# EAGLE design Hardware_v4 (EAGLE 9.3.1)
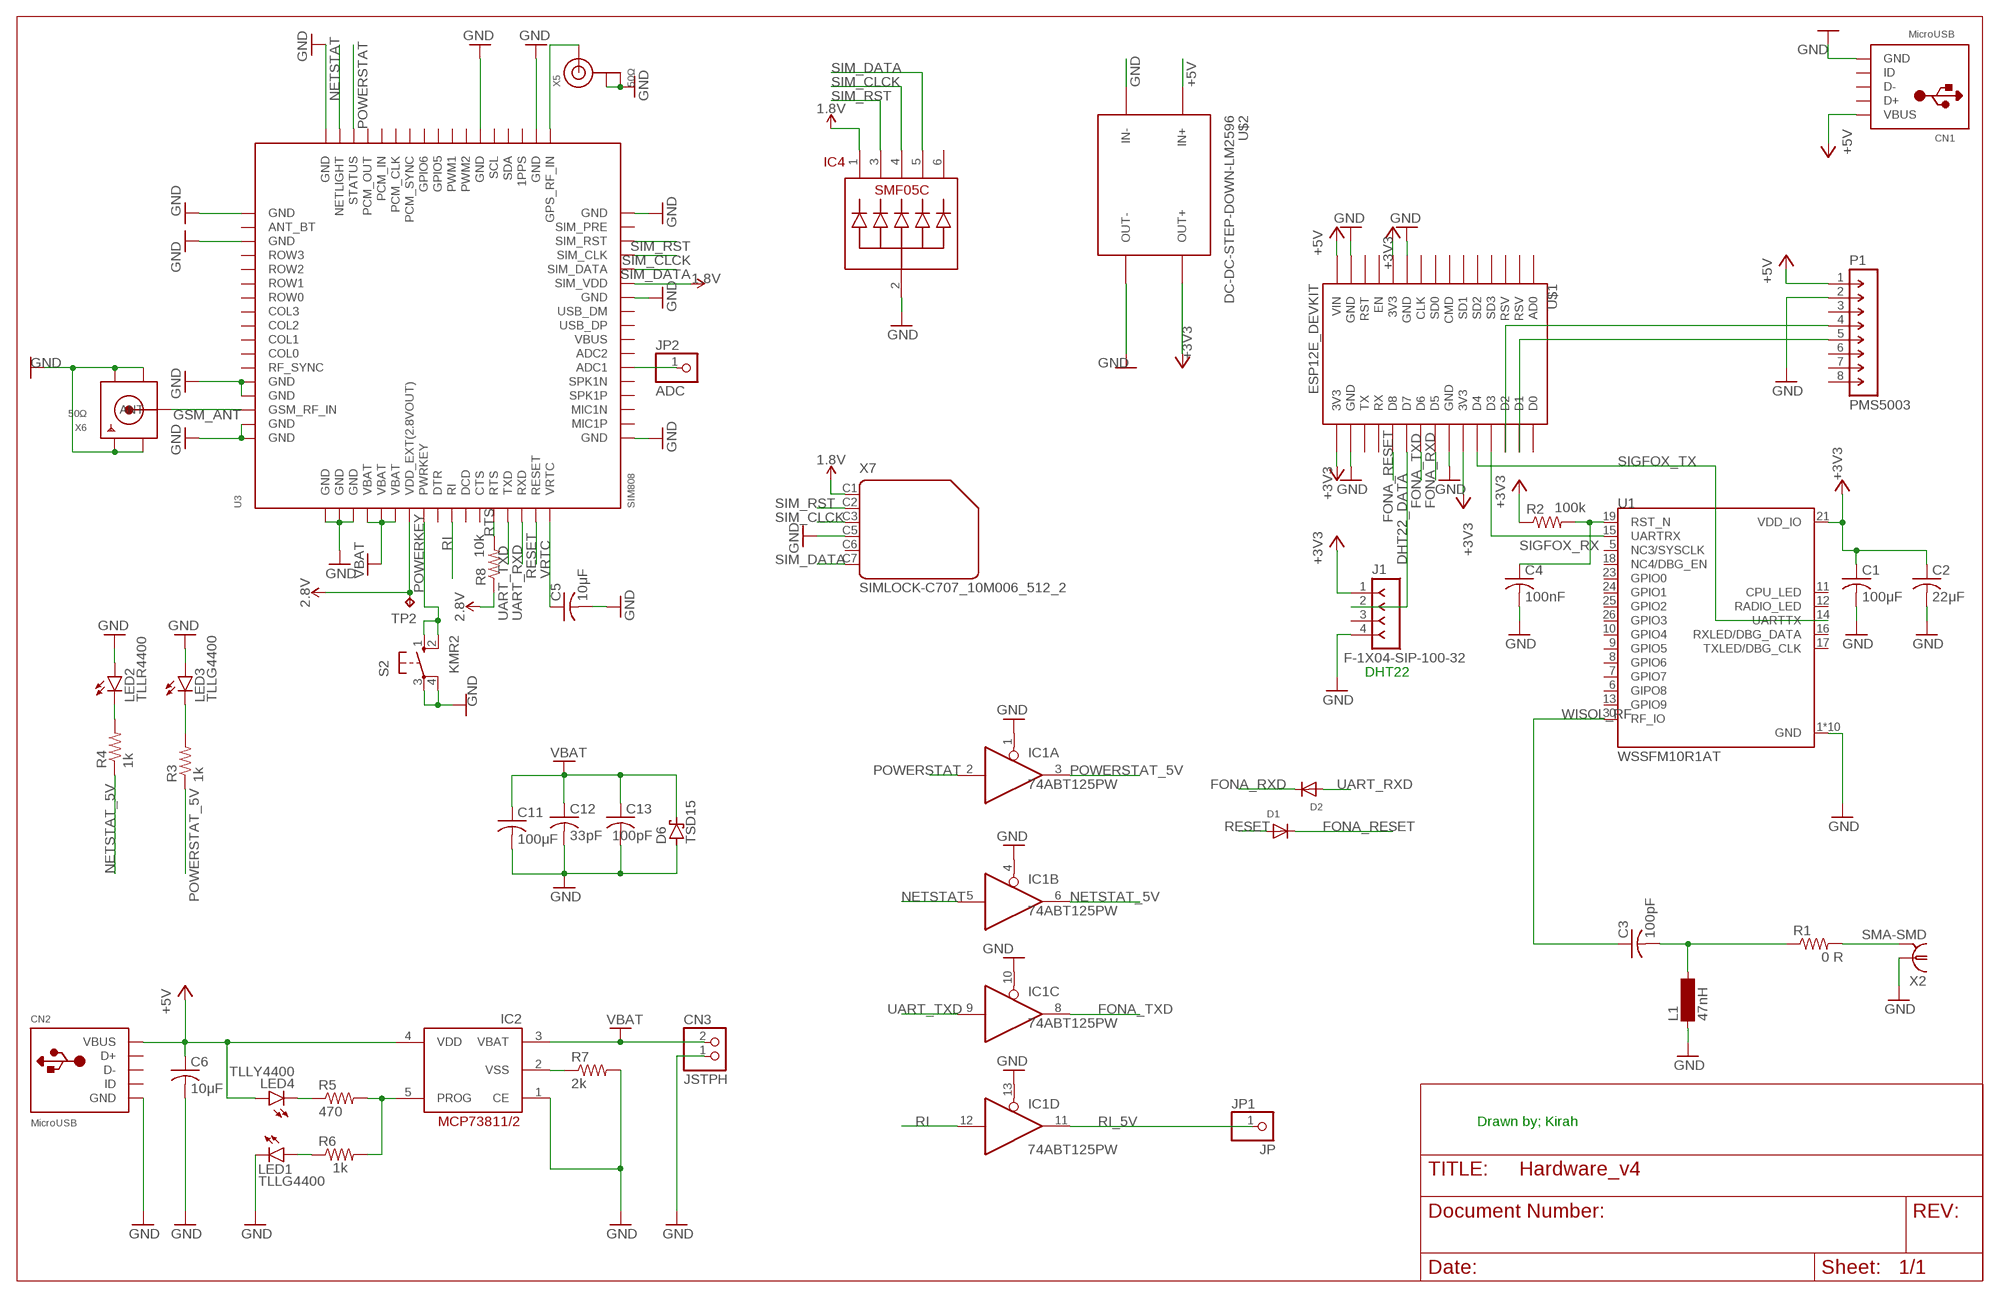
[diagram p0: schematic, sheet 1]

## Parts
C1  100μF  C-USC0201  [C0201]
C2  22μF  C-USC0201  [C0201]
C3  100pF  C-USC0402K  [C0402K]
C4  100nF  C-USC0201  [C0201]
C5  10μF  C-USC0201  [C0201]
C6  10μF  C-USC0201  [C0201]
C11  100μF  C-USC0402  [C0402]
C12  33pF  C-USC0402  [C0402]
C13  100pF  C-USC0402  [C0402]
CN1  MicroUSB  USBMINIB  [USB-MINIB]
CN2  MicroUSB  USBMINIB  [USB-MINIB]
CN3  JSTPH  JST_2PIN-SMT  [JST-PH-2-SMT]
D1  DIODESMA  [SMADIODE]
D2  DIODESMA  [SMADIODE]
D6  TSD15  [CB429-15]
IC1  74ABT125PW  [TSSOP14]
IC2  MCP73811/2  [SOT23-5L]
IC4  SMF05C  [SC-70-6]
J1  F-1X04-SIP-100-32  [SIP-100-04-32]
JP1  JP  PINHD-1X1CB  [1X01-CLEANBIG]
JP2  ADC  PINHD-1X01_2.00  [1X01M]
L1  47nH  SM-1206  [SM-1206]
LED1  TLLG4400  [LED3MM]
LED2  TLLR4400  [LED3MM]
LED3  TLLG4400  [LED3MM]
LED4  TLLY4400  [LED3MM]
P1  PMS5003  M-1X08-SIP-100-40  [SIP-100-08-40]
R1  0 R  R-US_01005  [R01005]
R2  100k  R-US_R0201  [R0201]
R3  1k  R-US_01005  [R01005]
R4  1k  R-US_01005  [R01005]
R5  470  R-US_01005  [R01005]
R6  1k  R-US_01005  [R01005]
R7  2k  R-US_01005  [R01005]
R8  10k  R-US_01005  [R01005]
S2  KMR2  40/XX  [B3F/40XX]
TP2  TPTP10R  [TP10R]
U1  WSSFM10R1AT  [XCVR_WSSFM10R1AT]
U3  SIM808  GSM_SIM808_LITERAL  [SIM900_SMT]
U$1  ESP12E_DEVKIT  [ESP12E_DEVKIT]
U$2  DC-DC-STEP-DOWN-LM2596  [DC-DC-STEP-DOWN-LM2596]
X2  SMA-SMD  [SMA-SMD]
X5  50Ω  ANTENNA_U.FL  [U.FL]
X6  50Ω  SMACONNECTOR_EDGE_UFL  [SMA_EDGELAUNCH_UFL]
X7  SIMLOCK-C707_10M006_512_2  [C707_10M006_512_2]

## Nets
1.8V [POWER]: IC4.1 U3.P$29(SIM_VDD) X7.C1
2.8V [POWER]: R8.1 TP2.TP U3.P$7(VDD_EXT(2.8VOUT))
+3V3 [POWER]: C1.1 C2.1 J1.1 R2.1 U1.21(VDD_IO) U$1.3V3@0(3V3) U$1.3V3@1(3V3) U$1.3V3@2(3V3) U$2.OUT+
+5V [POWER]: C6.1 CN1.VBUS CN2.VBUS IC2.4(VDD) LED4.A P1.1 U$1.VIN U$2.IN+
DHT22_DATA: J1.2 U$1.D7
FONA_RESET: D1.C U$1.D8
FONA_RXD: D2.C U$1.D5
FONA_TXD: IC1.8(C:O) U$1.D6
GND [GND]: C1.2 C2.2 C4.2 C5.2 C6.2 C11.2 C12.2 C13.2 CN1.GND CN2.GND CN3.1 D6.A IC1.1(A:OE) IC1.4(B:OE) IC1.10(C:OE) IC1.13(D:OE) IC2.1(CE) IC4.2 J1.4 L1.1 LED1.K(C) LED2.A LED3.A P1.2 R7.2 S2.3(P) S2.4(P1) U1.1(GND) U1.2(GND) U1.3(GND) U1.4(GND) U1.20(GND) U1.22(GND) U1.27(GND) U1.28(GND) U1.29(GND) U1.31(GND) U3.P$1(GND) U3.P$2(GND) U3.P$3(GND) U3.P$18(GND) U3.P$28(GND) U3.P$34(GND) U3.P$36(GND) U3.P$40(GND) U3.P$51(GND) U3.P$52(GND) U3.P$54(GND) U3.P$64(GND) U3.P$65(GND) U3.P$67(GND) U3.P$68(GND) U$1.GND@0(GND) U$1.GND@1(GND) U$1.GND@2(GND) U$1.GND@3(GND) U$2.IN- U$2.OUT- X2.1 X5.1(GND) X5.2(GND) X6.GND@1(GND1) X6.GND@2(GND2) X6.GND@3(GND3) X6.GND@4(GND4) X7.C5
GSM_ANT: U3.P$66(GSM_RF_IN) X6.P(ANT)
N$2: C4.1 R2.2 U1.19(RST_N)
N$3: P1.4 U$1.D2
N$4: P1.5 U$1.D1
N$5: C3.2 L1.2 R1.1
N$6: U3.P$35(GPS_RF_IN) X5.3(SIGNAL)
N$12: R1.2 X2.2@1 X2.2@2 X2.2@3 X2.2@4 X2.2@5 X2.2@6
N$13: JP2.1 U3.P$23(ADC1)
N$18: LED2.K(C) R4.2
N$21: LED3.K(C) R3.2
N$35: LED4.K(C) R5.1
N$36: IC2.5(PROG) R5.2 R6.2
N$37: LED1.A R6.1
NETSTAT: IC1.5(B:I) U3.P$50(NETLIGHT)
NETSTAT_5V: IC1.6(B:O) R4.1
POWERKEY: S2.1(S) S2.2(S1) U3.P$8(PWRKEY)
POWERSTAT: IC1.2(A:I) U3.P$49(STATUS)
POWERSTAT_5V: IC1.3(A:O) R3.1
RESET: D1.A U3.P$16(RESET)
RI: IC1.12(D:I) U3.P$10(RI)
RI_5V: IC1.11(D:O) JP1.1
RTS: R8.2 U3.P$13(RTS)
SIGFOX_RX: U1.15(UARTRX) U$1.D3
SIGFOX_TX: U1.14(UARTTX) U$1.D4
SIM_CLCK: IC4.4 U3.P$31(SIM_CLK) X7.C3
SIM_DATA: IC4.5 U3.P$30(SIM_DATA) X7.C7
SIM_RST: IC4.3 U3.P$32(SIM_RST) X7.C2
UART_RXD: D2.A U3.P$15(RXD)
UART_TXD: IC1.9(C:I) U3.P$14(TXD)
VBAT: C11.1 C12.1 C13.1 CN3.2 D6.C IC2.3(VBAT) U3.P$4(VBAT) U3.P$5(VBAT) U3.P$6(VBAT)
VRTC: C5.1 U3.P$17(VRTC)
VSS: IC2.2(VSS) R7.1
WISOL_RF: C3.1 U1.30(RF_IO)
Unconnected: CN1.D+ CN1.D- CN1.ID CN2.D+ CN2.D- CN2.ID IC4.6 J1.3 P1.3 P1.6 P1.7 P1.8 U1.5(NC3/SYSCLK) U1.6(GIPO8) U1.7(GPIO7) U1.8(GPIO6) U1.9(GPIO5) U1.10(GPIO4) U1.11(CPU_LED) U1.12(RADIO_LED) U1.13(GPIO9) U1.16(RXLED/DBG_DATA) U1.17(TXLED/DBG_CLK) U1.18(NC4/DBG_EN) U1.23(GPIO0) U1.24(GPIO1) U1.25(GPIO2) U1.26(GPIO3) U3.P$9(DTR) U3.P$11(DCD) U3.P$12(CTS) U3.P$19(MIC1P) U3.P$20(MIC1N) U3.P$21(SPK1P) U3.P$22(SPK1N) U3.P$24(ADC2) U3.P$26(USB_DP) U3.P$27(USB_DM) U3.P$33(SIM_PRE) U3.P$37(1PPS) U3.P$38(SDA) U3.P$39(SCL) U3.P$41(PWM2) U3.P$42(PWM1) U3.P$43(GPIO5) U3.P$44(GPIO6) U3.P$45(PCM_SYNC) U3.P$46(PCM_CLK) U3.P$47(PCM_IN) U3.P$48(PCM_OUT) U3.P$53(ANT_BT) U3.P$55(ROW3) U3.P$56(ROW2) U3.P$57(ROW1) U3.P$58(ROW0) U3.P$59(COL3) U3.P$60(COL2) U3.P$61(COL1) U3.P$62(COL0) U3.P$63(RF_SYNC) U$1.AD0 U$1.CLK U$1.CMD U$1.D0 U$1.EN U$1.RST U$1.RSV@0(RSV) U$1.RSV@1(RSV) U$1.RX U$1.SD0 U$1.SD1 U$1.SD2 U$1.SD3 U$1.TX X7.C6

## Notes on the sheet
- DHT22
- Drawn by; Kirah

## Power pins joined to a net without a drawn wire
GND: IC1.7(P:GND)
VBUS: U3.P$25(VBUS)
VCC: IC1.14(P:VCC)

## Library data of the parts
C1-C6 C11-C13 = rcl:C-US: CAPACITOR, American symbol; SPICEPREFIX: C
CN1 = adafruit:USB: USB Connectors USBMINIB - Surface Mount Female Mini-B USB Connector 4UConnector: 06564 By microbuilder.eu Thru-hole RA Female Mini-B USB Connector 4UConnector: 18732 By ladyada.net
CN2 = adafruit@1:USB: USB Connectors USBMINIB - Surface Mount Female Mini-B USB Connector 4UConnector: 06564 By microbuilder.eu Thru-hole RA Female Mini-B USB Connector 4UConnector: 18732 By ladyada.net
CN3 = adafruit:JST_2PIN: JST 2-Pin Connectors of various flavors SMT-RA (S2B-PH-SM4) 4UConnector #17311 SMT (B2B-PH-SM4) THM-RA (S2B-PH) THM (B2B-PH)
D1 D2 = adafruit:DIODE: Diode SMADIODE - SMA Surface Mount Package 20V 1A Schottky Diode Digikey: 641-1014-6-ND DO-1N4148 - Through Hole Small Current Diode SOD-123 20V 1 A (.5mV Vf) Schottky Diode - Digikey: MBRX120TPMSCT-ND SOD-323 10V 570mA (.38mV Vf, 3ns) Schottky Diode - Digikey: ZLLS410CT-ND SOD-523 30V 30mA Schottky Diode (RB751S-40TE61) - Digikey: RB751S-40TE61CT-ND SOT23-R/W - SOT23 Package (R = Solder Paste/Reflow Ovens, W = Hand-Soldering) BAT54Film 40V 300mA - Digikey: 497-7162-1-ND
D6 = diode:TSD15: DIODE
IC1 = 74xx-eu:74*125: Quad bus BUFFER, 3-state
IC2 = adafruit:MCP73811/2: MCP73811 and MCP73812 Simple, Miniature Single-Cell, Fully Integrated Li-Ion / Li-Polymer Charge Management Controllers SOT-23-5 package, no indicator LED but with adjustable current, small and very inexpensive
IC4 = smf05c:SMF05C
J1 = con-headers-jp:F-1X04-: FEMALE HEADER
JP1 = adafruit@2:PINHD-1X1: Pin header 1x1 for 0.1" spacing With round pins
JP2 = pinhead-2:PINHD-1X01: PIN HEADER
L1 = inductor-neosid:SM-1206: INDUCTOR SMD chip inductor; OC_FARNELL: unknown; OC_NEWARK: unknown
LED1 LED3 = led:TLLG4400: Low Current (2mA) LED 3 mm Tinted Diffused Package color GREEN Source: Data sheet <http://www.farnell.com/datasheets/391098.pdf>; MF: VISHAY SEMICONDUCTOR; OC_FARNELL: 1612435
LED2 = led:TLLR4400: Low Current (2mA) LED 3 mm Tinted Diffused Package color RED Source: Data sheet <http://www.farnell.com/datasheets/391100.pdf>; MF: VISHAY SEMICONDUCTOR; OC_FARNELL: 1612437
LED4 = led:TLLY4400: Low Current (2mA) LED 3 mm Tinted Diffused Package color YELLOW Source: Data sheet <http://www.farnell.com/datasheets/391098.pdf>; MF: VISHAY SEMICONDUCTOR; OC_FARNELL: 1612439
P1 = con-headers-jp:M-1X08-: MALE HEADER
R1-R8 = rcl:R-US_: RESISTOR, American symbol; SPICEPREFIX: R
S2 = switch-omron:40/XX: OMRON SWITCH; OC_FARNELL: unknown; OC_NEWARK: unknown
TP2 = testpad:TP: Test pad
U1 = WSSFM10R1AT:WSSFM10R1AT: Sigfox RF Module, Sub-1GHz , SMD; AVAILABILITY: Unavailable; DESCRIPTION: Sigfox Module Rcz1 At Version; MF: Avnet Design Services; MP: WSSFM10R1AT; PACKAGE: None; PRICE: None
U3 = adafruit:GSM_SIM808_LITERAL: SIM808 GSM Module
U$1 = ESP12E_DEVKIT:ESP12E_DEVKIT: ESP12E DEVKIT BOARD
U$2 = diy-modules:DC-DC-STEP-DOWN-LM2596: DC/DC Step-Down Regulator based on LM2596-ADJ chip LM2596 datasheet available here: http://www.ti.com/lit/ds/symlink/lm2596.pdf Click here to find device on ebay.com <http://www.ebay.com/sch/lm2596+power+regulator>
X2 = con-coax:SMA-SMD: SMA 50 Ohm Straight Jack Receptacle - Surface Mount www.johnsoncomponents.com Source: http://catalog.digikey.com .. 142-0711-201, 205, 202, 206.pdf; OC_FARNELL: unknown; OC_NEWARK: unknown
X5 = adafruit:ANTENNA_U.FL: U.FL Antenna Connector
X6 = adafruit@1:SMACONNECTOR: SMA Connector 90° DIP SMA Connector, 50 Ohm (4UConnector: 07259)
X7 = con-amphenol:SIMLOCK-C707_10M006_512_2: C707A SIMLOCK® 2.5 mm with wide solder tails Source: Data sheet <http://www.amphenol.info/downloads/C707_10M006_512_2.pdf>; OC_FARNELL: unknown; OC_NEWARK: unknown

## Net classes
1 POWER: width 0.305 mm
2 GND: width 0.254 mm

## Board
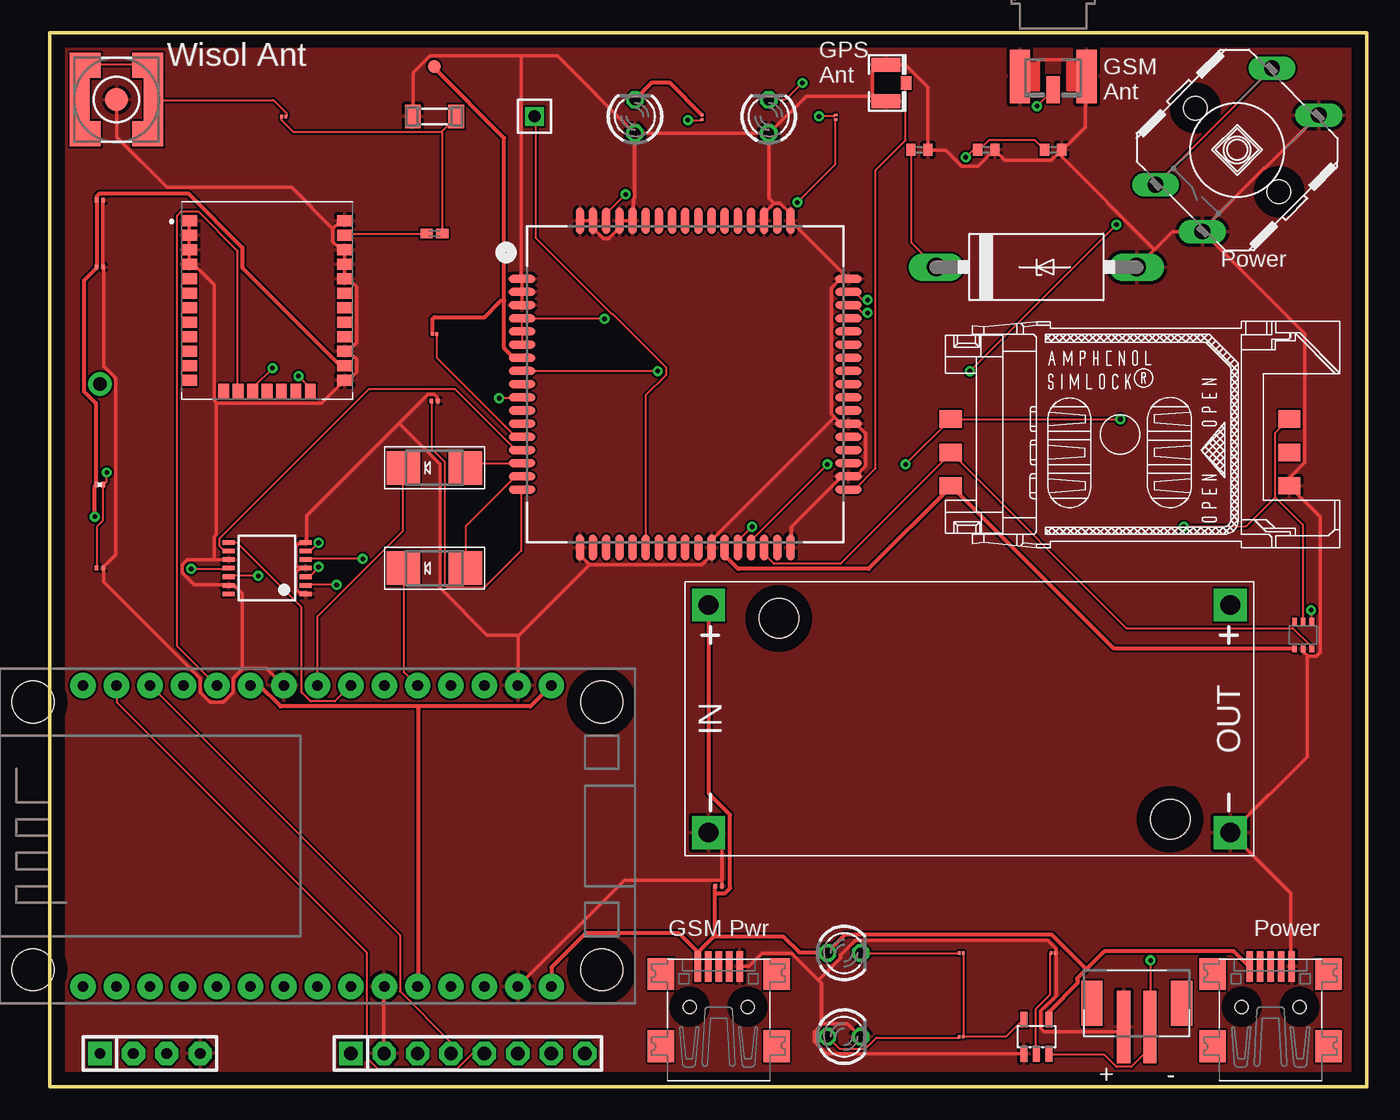
[diagram p1: board, top side]
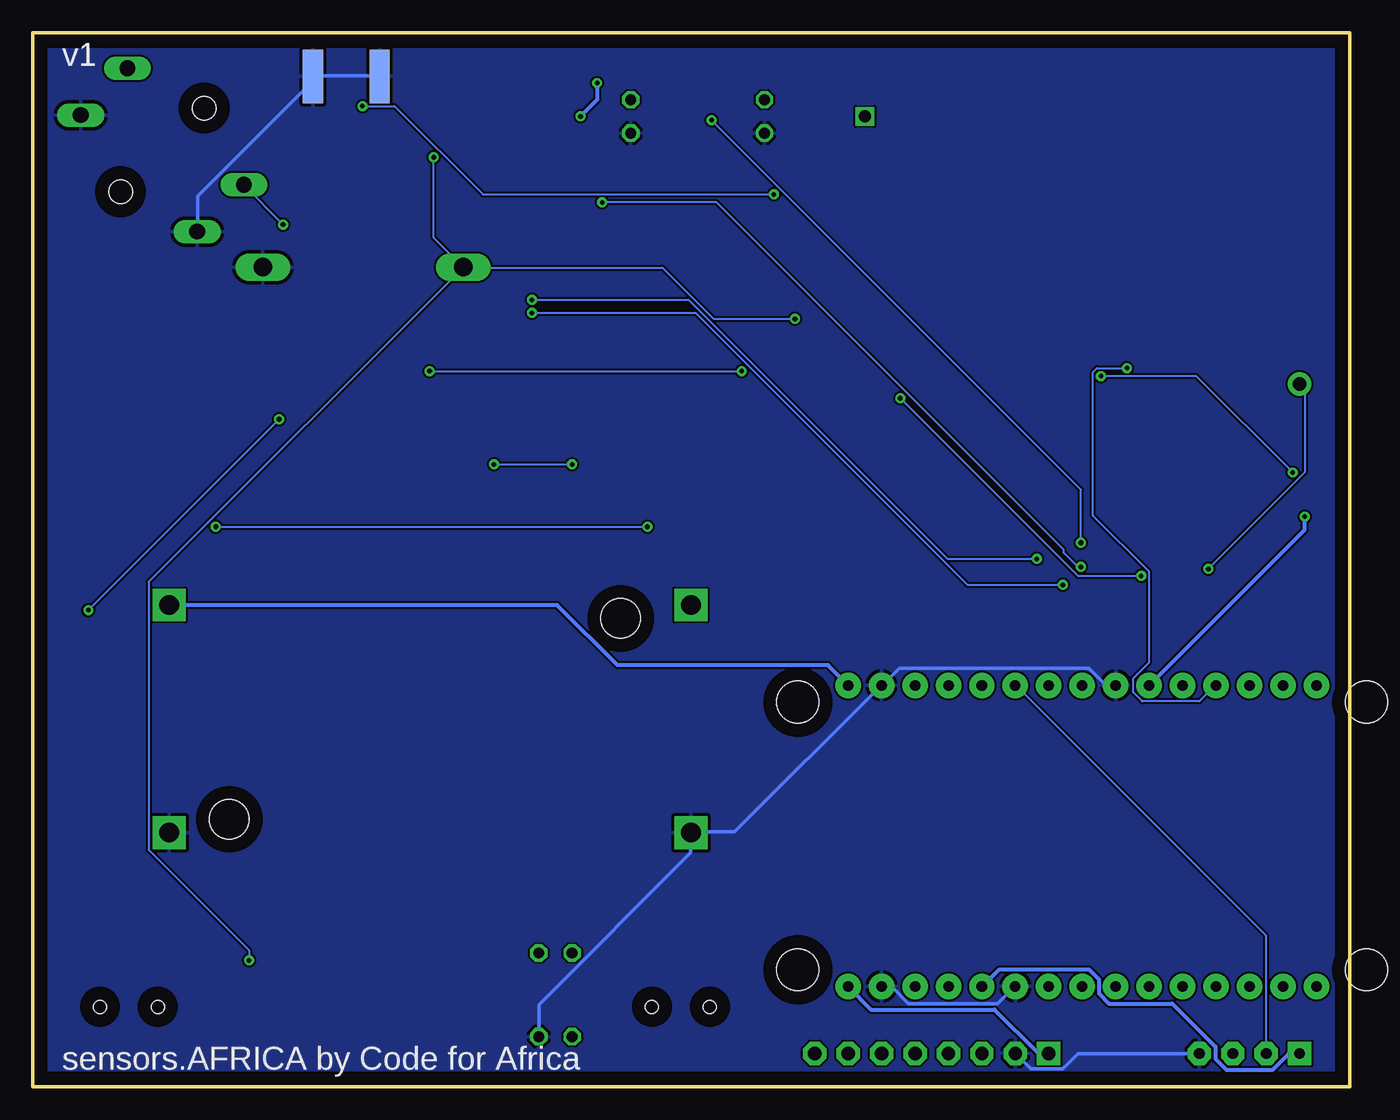
[diagram p2: board, bottom side, seen from below]

Size 100 x 80 mm. Coordinates in mm from the lower left corner, seen from the top.
Outline: 0,0 100,0 100,80 0,80 0,0
Copper layers (1*16): Top 0.035mm / dielectric 1.5mm / Bottom 0.035mm
Design rules "default": minimum track width 6mil, minimum drill 0.35mm, track to track 6mil, track to pad 6mil, pad to pad 6mil, via to via 6mil, smd to smd 6mil, copper to edge 40mil, drill to drill 6mil, minimum pad ring 10mil, minimum via ring 8mil, stop-mask expansion 4mil, vias tented up to drill 0mil, thermal gap 10mil

### Footprints (pad centres in the part's own frame; a part is rotated, then mirrored left to right if it is on the bottom)
C0201 = smd 0.25 x 0.35: 1 -0.25,0; 2 0.25,0
C0402K = smd 0.925 x 0.74: 1 -0.6,0; 2 0.6,0
C0402 = smd 0.7 x 0.9: 1 -0.65,0; 2 0.65,0
USB-MINIB = smd 0.5 x 2.308: D+ 0,4.064; D- -0.8,4.064; GND 1.6,4.064; ID 0.8,4.064; VBUS -1.6,4.064 | smd 2 x 2.4: GND1 -4.4,-2; GND2 -4.4,3.5; GND3 4.4,3.5; GND4 4.4,-2 | hole 1: -2.2,1; 2.2,1
JST-PH-2-SMT = smd 1 x 5.5: 1 -1,-1.8; 2 1,-1.8 | smd 1.6 x 3.4: NC1 -3.4,0; NC2 3.4,0
SMADIODE = smd 2.54 x 2.54: A 2.349,0; C -2.349,0
CB429-15 = drill 1.397 long: A 7.62,0; C -7.62,0
TSSOP14 = smd 0.35 x 0.9: 1 -1.95,-2.925; 2 -1.3,-2.925; 3 -0.65,-2.925; 4 0,-2.925; 5 0.65,-2.925; 6 1.3,-2.925; 7 1.95,-2.925; 8 1.95,2.925; 9 1.3,2.925; 10 0.65,2.925; 11 0,2.925; 12 -0.65,2.925; 13 -1.3,2.925; 14 -1.95,2.925
SOT23-5L = smd 0.55 x 1.2: 1 -0.95,-1.3; 2 0,-1.3; 3 0.95,-1.3; 4 0.95,1.3; 5 -0.95,1.3
SC-70-6 = smd 0.35 x 0.5: 1 -0.65,-1.05; 2 0,-1.05; 3 0.65,-1.05; 4 0.65,1.05; 5 0,1.05; 6 -0.65,1.05
SIP-100-04-32 = drill 0.813 pad 1.778 square: 1 -3.81,0 | drill 0.813 pad 1.778 octagon: 2 -1.27,0; 3 1.27,0; 4 3.81,0
1X01-CLEANBIG = drill 1.016 pad 1.778: 1 0,0
1X01M = drill 0.914 square: 1 0,0
SM-1206 = smd 1.2 x 1.8: 1 -1.65,0; 2 1.65,0
LED3MM = drill 0.813 octagon: A -1.27,0; K 1.27,0
SIP-100-08-40 = drill 1.016 pad 1.778 square: 1 -8.89,0 | drill 1.016 pad 1.778 octagon: 2 -6.35,0; 3 -3.81,0; 4 -1.27,0; 5 1.27,0; 6 3.81,0; 7 6.35,0; 8 8.89,0
R01005 = smd 0.2 x 0.25: 1 -0.163,0; 2 0.163,0
R0201 = smd 0.28 x 0.43: 1 -0.255,0; 2 0.255,0
B3F/40XX = drill 1.194 long: 1 -6.198,-2.642; 2 2.642,6.198; 3 -2.642,-6.198; 4 6.198,2.642 | hole 1.803: -3.175,3.175; 3.175,-3.175
TP10R = smd 1 x 1: TP 0,0
XCVR_WSSFM10R1AT = smd 1.15 x 0.81: 1 -5.9,6.05; 2 -5.9,4.95; 3 -5.9,3.85; 4 -5.9,2.75; 5 -5.9,1.65; 6 -5.9,0.55; 7 -5.9,-0.55; 8 -5.9,-1.65; 9 -5.9,-2.75; 10 -5.9,-3.85; 11 -5.9,-4.95; 12 -5.9,-6.05; 20 5.9,-6.05; 21 5.9,-4.95; 22 5.9,-3.85; 23 5.9,-2.75; 24 5.9,-1.65; 25 5.9,-0.55; 26 5.9,0.55; 27 5.9,1.65; 28 5.9,2.75; 29 5.9,3.85; 30 5.9,4.95; 31 5.9,6.05 | smd 0.81 x 1.15: 13 -3.3,-6.9; 14 -2.2,-6.9; 15 -1.1,-6.9; 16 0,-6.9; 17 1.1,-6.9; 18 2.2,-6.9; 19 3.3,-6.9
SIM900_SMT = smd 2 x 0.6: P$1 -12.4,8; P$2 -12.4,7; P$3 -12.4,6; P$4 -12.4,5; P$5 -12.4,4; P$6 -12.4,3; P$7 -12.4,2; P$8 -12.4,1; P$9 -12.4,0; P$10 -12.4,-1; P$11 -12.4,-2; P$12 -12.4,-3; P$13 -12.4,-4; P$14 -12.4,-5; P$15 -12.4,-6; P$16 -12.4,-7; P$17 -12.4,-8; P$35 12.4,-8; P$36 12.4,-7; P$37 12.4,-6; P$38 12.4,-5; P$39 12.4,-4; P$40 12.4,-3; P$41 12.4,-2; P$42 12.4,-1; P$43 12.4,0; P$44 12.4,1; P$45 12.4,2; P$46 12.4,3; P$47 12.4,4; P$48 12.4,5; P$49 12.4,6; P$50 12.4,7; P$51 12.4,8 | smd 0.6 x 2: P$18 -8,-12.4; P$19 -7,-12.4; P$20 -6,-12.4; P$21 -5,-12.4; P$22 -4,-12.4; P$23 -3,-12.4; P$24 -2,-12.4; P$25 -1,-12.4; P$26 0,-12.4; P$27 1,-12.4; P$28 2,-12.4; P$29 3,-12.4; P$30 4,-12.4; P$31 5,-12.4; P$32 6,-12.4; P$33 7,-12.4; P$34 8,-12.4; P$52 8,12.4; P$53 7,12.4; P$54 6,12.4; P$55 5,12.4; P$56 4,12.4; P$57 3,12.4; P$58 2,12.4; P$59 1,12.4; P$60 0,12.4; P$61 -1,12.4; P$62 -2,12.4; P$63 -3,12.4; P$64 -4,12.4; P$65 -5,12.4; P$66 -6,12.4; P$67 -7,12.4; P$68 -8,12.4
ESP12E_DEVKIT = drill 0.8 pad 1.93: 3V3@0 -11.43,-7.62; 3V3@1 11.43,5.08; 3V3@2 11.43,-17.78; AD0 -11.43,17.78; CLK -11.43,-2.54; CMD -11.43,2.54; D0 11.43,17.78; D1 11.43,15.24; D2 11.43,12.7; D3 11.43,10.16; D4 11.43,7.62; D5 11.43,0; D6 11.43,-2.54; D7 11.43,-5.08; D8 11.43,-7.62; EN -11.43,-10.16; GND@0 -11.43,-5.08; GND@1 -11.43,-15.24; GND@2 11.43,2.54; GND@3 11.43,-15.24; RST -11.43,-12.7; RSV@0 -11.43,15.24; RSV@1 -11.43,12.7; RX 11.43,-10.16; SD0 -11.43,0; SD1 -11.43,5.08; SD2 -11.43,7.62; SD3 -11.43,10.16; TX 11.43,-12.7; VIN -11.43,-17.78 | hole 3.2: -10.16,21.59; 10.16,21.59; 10.16,-21.59; -10.16,-21.59
DC-DC-STEP-DOWN-LM2596 = drill 1.5 pad 2.5 square: IN+ -19.812,8.636; IN- -19.812,-8.636; OUT+ 19.812,8.636; OUT- 19.812,-8.636 | hole 3: -14.478,7.62; 15.24,-7.62
SMA-SMD = smd 1.73 x 1.73: 1 0,0 | smd 2.35 x 1.9: 2@1 -2.375,2.6; 2@2 -2.375,-2.6; 2@3 2.375,-2.6; 2@4 2.375,2.6 | smd 1.5 x 3.4: 2@5 -2.8,0; 2@6 2.8,0
U.FL = smd 2.2 x 1.05: 1 0,1.375; 2 0,-1.375 | smd 0.8 x 1: 3 1.525,0
SMA_EDGELAUNCH_UFL = smd 4.064 x 1.524: GND@1 2.032,-2.54; GND@2 2.032,2.54 | smd 4.064 x 1.524 bottom: GND@3 2.032,2.54; GND@4 2.032,-2.54 | smd 2.032 x 1.016: P 3.048,0
C707_10M006_512_2 = smd 1.7 x 1.3: C1 -12.85,-3.915; C2 -12.85,-1.375; C3 -12.85,1.165; C5 12.85,-3.915; C6 12.85,-1.375; C7 12.85,1.165

### Placement (x,y rotation side)
C1  3.81,67.31 0 top
C2  3.81,62.23 0 top
C3  29.22,64.77 0 top
C4  3.81,39.37 0 top
C5  29.22,52.07 0 top
C6  50.8,15.24 0 top
C11  66.04,71.12 0 top
C12  71.12,71.12 0 top
C13  76.2,71.12 0 top
CN1  92.71,5.08 0 top
CN2  50.8,5.08 0 top
CN3  82.55,6.35 0 top
D1  29.21,39.37 0 top
D2  29.21,46.99 0 top
D6  74.93,62.23 0 top
IC1  16.51,39.37 90 top
IC2  74.93,3.81 0 top
IC4  95.19,34.29 0 top
J1  7.62,2.54 0 top
JP1  3.81,53.34 0 top
JP2  36.83,73.66 0 top
L1  29.22,73.66 0 top
LED1  60.33,3.81 0 top
LED2  44.45,73.66 90 top
LED3  54.61,73.66 90 top
LED4  60.33,10.16 0 top
P1  31.75,2.54 0 top
R1  17.78,73.66 0 top
R2  3.81,45.72 0 top
R3  59.69,73.6 90 top
R4  49.53,73.6 90 top
R5  69.22,10.16 0 top
R6  69.22,3.81 0 top
R7  76.2,10.16 0 top
R8  29.22,57.15 0 top
S2  90.17,71.12 0 top
TP2  29.22,77.47 0 top
U1  16.51,59.69 0 top
U3  48.26,53.34 0 top
U$1  20.32,19.05 90 top
U$2  69.85,27.94 0 top
X2  5.08,74.93 0 top
X5  63.5,76.2 0 top
X6  76.2,78.74 270 top
X7  81.28,49.53 0 top

### Tracks (layer width: path | path; a pad name or v marks a point on that pad's centre or on a via)
1.8V
  Top 0.305: IC4.1 94.49,33.3 80.77,33.3 68.5,45.57 X7.C1 68.35,45.49 62.18,39.32 52.27,39.32 51.28,40.31 51.28,40.92 U3.P$29
2.8V
  Top 0.305: 34.52,59.69 34.52,56.08 35.2,55.4 35.81,55.4 U3.P$7 | 34.52,59.69 34.52,72.01 29.26,77.27 29.26,77.42 TP2.TP | R8.1 29.06,58.27 29.21,58.42 33.02,58.42 34.29,59.69 34.52,59.69
+3V3  (via drill 0.35)
  Top 0.305: U1.21 22.4,54.79 22.02,54.79 14.63,62.18 14.63,63.7 10.52,67.82 3.81,67.82 3.58,67.59 3.58,67.44 C1.1 3.58,67.28 3.58,62.26 C2.1 3.5,62.1 2.59,61.19 2.59,52.81 3.5,51.89 3.5,45.72 R2.1 3.43,45.64 v3.43,43.28 | U$1.3V3@1 15.93,30.48 17.53,28.88 27.96,28.88 | 27.96,28.88 36.5,28.88 U$1.3V3@2 | 27.96,28.88 27.96,7.62 U$1.3V3@0
  Bottom 0.305: J1.1 3.81,2.52 4.65,2.52 5.87,1.29 9.37,1.29 10.21,2.13 10.21,3.05 13.49,6.33 18.29,6.33 19.05,7.09 19.05,8.15 19.81,8.91 26.59,8.91 27.89,7.62 U$1.3V3@0 | U$2.OUT+ 60.2,36.58 55.63,32 39.62,32 U$1.3V3@2 | v3.43,43.28 3.43,42.29 U$1.3V3@1
+5V
  Top 0.305: 78.72,8.91 80.09,10.29 89.92,10.29 91.06,9.14 CN1.VBUS | 78.72,8.91 78.03,8.23 78.03,7.85 75.89,5.71 75.89,5.18 IC2.4 | 50.52,11.51 50.52,14.71 | 50.52,14.71 50.52,15.24 C6.1 | 50.52,11.51 49.23,10.21 49.23,9.14 CN2.VBUS 49.15,10.29 47.78,11.66 40.69,11.66 38.1,9.07 U$1.VIN | 50.52,11.51 50.6,11.43 55.7,11.43 56.92,10.21 59.05,10.21 LED4.A 59.13,10.29 60.43,11.58 76.05,11.58 78.72,8.91 | 50.52,14.71 51.28,14.71 51.66,15.09 51.66,20.65 50.06,22.25 50.06,36.58 U$2.IN+
  Bottom 0.305: U$1.VIN 36.35,5.87 26.98,5.87 23.7,2.59 22.86,2.59 P1.1
DHT22_DATA
  Bottom 0.152: J1.2 6.4,2.59 6.4,11.51 25.38,30.48 U$1.D7
FONA_RESET
  Top 0.152: D1.C 26.9,39.32 26.9,31.47 27.89,30.48 U$1.D8
FONA_RXD
  Top 0.152: D2.C 26.82,46.94 26.82,42.22 20.34,35.74 20.34,30.48 U$1.D5
FONA_TXD
  Top 0.152: U$1.D6 21.64,29.26 19.81,29.26 19.13,29.95 19.13,36.42 14.25,41.3 13.64,41.3 IC1.8
GND
  Top 0.254: CN3.1 81.53,4.5 81.23,4.19 75.51,4.19 75.29,4.42 75.29,5.79 76.43,6.93 76.43,10.13 R7.2 76.43,10.21 76.43,10.44 75.74,11.12 61.19,11.12 60.05,9.98 60.05,9.75 58.37,8.08 | 58.67,4.8 58.06,4.19 58.06,3.43 58.98,2.52 73.91,2.52 IC2.1 | 58.67,4.8 60.58,4.8 61.57,3.81 LED1.K | CN2.GND 53.11,9.14 54.1,10.13 56.31,10.13 58.37,8.08 | 58.37,8.08 58.6,7.85 58.6,4.88 58.67,4.8 | 51.05,15.7 51.05,18.29 U$2.IN- | 51.05,15.7 C6.2 | U$1.GND@0 25.38,7.62 25.38,2.59 P1.2 | 51.05,15.7 43.66,15.7 35.59,7.62 U$1.GND@1 | U1.1 10.59,65.68 10.59,64.69 U1.2 10.59,64.54 10.59,63.63 U1.3 10.59,63.48 10.59,62.48 U1.4 10.67,62.33 11.05,62.33 12.5,60.88 12.5,52.12 12.72,51.89 | 21.49,65.15 22.02,65.68 22.4,65.68 U1.31 | 21.49,65.15 21.49,64.16 22.02,63.63 22.33,63.63 U1.29 22.4,63.48 22.4,62.56 U1.28 22.4,62.41 U1.27 22.48,61.27 22.78,61.27 23.32,60.73 23.32,56.46 22.86,56.01 22.86,55.85 U1.22 22.48,55.78 22.78,55.78 23.32,55.24 23.32,54.25 22.71,53.65 22.48,53.65 U1.20 22.33,53.57 20.65,51.89 12.72,51.89 | 21.49,65.15 18.36,68.28 8.91,68.28 5.11,72.08 5.11,74.91 X2.1 | C1.2 4.04,67.28 4.04,62.26 C2.2 4.12,62.18 4.12,54.71 5.03,53.8 5.03,40.39 4.12,39.47 C4.2 4.12,39.32 4.12,38.33 11.43,31.01 11.43,29.95 12.19,29.18 13.18,29.18 13.95,29.95 13.95,31.01 14.71,31.77 | 14.71,31.77 16.46,31.77 17.75,30.48 U$1.GND@2 | 14.71,31.77 14.63,31.85 14.63,37.41 14.02,38.02 13.64,38.02 IC1.13 13.49,38.1 10.97,38.1 10.06,39.01 10.06,39.62 10.44,40.01 12.5,40.01 | 12.5,40.01 13.56,40.01 IC1.10 | 12.5,40.01 12.5,41.76 12.65,41.91 12.65,51.82 12.72,51.89 | 18.97,39.32 18.67,39.01 18.67,37.8 18.97,37.49 19.43,37.49 IC1.1
  Top 0.254: 18.97,39.32 19.43,39.32 IC1.4 | 26.52,50.37 19.51,43.36 19.51,41.38 IC1.7 19.36,41.22 18.9,41.22 18.67,41 18.67,39.62 18.97,39.32 | 26.52,50.37 28.73,52.58 29.18,52.58 29.41,52.35 29.41,52.12 C5.2 | 41,39.62 40.31,40.31 40.31,40.92 U3.P$18 | 41,39.62 49.53,39.62 50.22,40.31 50.22,40.92 U3.P$28 50.37,41 50.37,41.6 59.59,50.83 | 35.59,34.21 35.59,30.48 U$1.GND@3 | 41,39.62 35.59,34.21 | 26.52,50.37 29.64,47.24 29.64,37.87 33.22,34.29 35.51,34.29 35.59,34.21 | 95.56,32.69 95.25,32.99 95.25,33.22 IC4.2 | 95.56,32.69 96.16,32.69 96.47,32.99 96.47,43.28 94.18,45.57 X7.C5 94.18,45.72 94.18,46.25 95.33,47.4 95.33,57.15 87.63,64.85 S2.3 | CN1.GND 94.26,9.14 94.26,14.71 U$2.OUT- 89.76,19.36 95.48,25.07 95.48,32.61 95.56,32.69 | S2.3 85.27,64.92 83.9,63.55 | 83.9,63.55 82.6,62.26 D6.A | S2.4 96.32,73.76 92.28,69.72 92.2,69.72 87.48,65 S2.3 | U3.P$68 40.31,65.76 41.22,65.76 U3.P$67 41.3,65.68 41.3,65.15 42.06,64.39 42.44,64.39 43.2,65.15 43.2,65.68 U3.P$65 43.28,65.76 44.2,65.76 U3.P$64 44.35,65.84 44.35,67.36 44.42,67.44 44.42,72.31 LED2.A | U3.P$3 35.89,59.36 35.89,60.27 U3.P$2 35.89,60.43 35.89,61.27 U3.P$1 35.81,61.42 35.81,78.26 | 35.81,78.26 38.56,78.26 44.42,72.39 LED2.A | 35.81,78.26 28.88,78.26 27.58,76.96 27.58,73.69 L1.1 | X6.GND@4 73.69,76.73 73.99,76.73 75.21,77.95 77.5,77.95 X6.GND@3 78.64,76.66 78.64,72.85 76.96,71.17 C13.2 | C13.2 76.81,71.09 76.05,70.33 72.54,70.33 71.86,71.02 C12.2 71.7,71.09 70.48,69.88 69.27,69.88 68.05,71.09 66.75,71.09 C11.2 66.67,71.25 66.67,75.89 65,77.57 63.63,77.57 X5.1 63.48,77.57 62.94,77.57 62.48,77.11 62.48,75.29 62.94,74.83 63.48,74.83 X5.2 62.41,75.21 57.45,75.21 54.71,72.47 LED3.A
  Top 0.254: U3.P$34 56.31,41 56.31,42.52 60.12,46.33 U3.P$36 60.73,46.41 61.27,46.41 61.95,47.09 61.95,49.61 61.27,50.29 60.73,50.29 U3.P$40 60.58,50.44 59.97,50.44 59.59,50.83 | 55.02,67.06 54.33,66.37 54.33,65.76 U3.P$54 | 55.02,67.06 55.47,67.06 56.24,66.29 56.24,65.76 U3.P$52 56.31,65.68 U3.P$51 60.27,61.57 59.36,60.66 59.36,51.05 59.59,50.83 | 55.02,67.06 54.63,67.44 54.63,72.39 LED3.A | LED3.A LED2.A | 83.9,63.55 76.66,70.79 C13.2
  Bottom 0.254: P1.2 24.23,1.37 21.79,1.37 20.65,2.52 11.43,2.52 J1.4 | U$1.GND@1 34.82,7.62 33.53,6.33 26.75,6.33 25.45,7.62 U$1.GND@0 | LED1.K 61.57,3.81 61.57,6.25 50.06,17.75 50.06,19.28 U$2.IN- 49.99,19.36 46.71,19.36 35.66,30.4 U$1.GND@3 35.51,30.48 34.21,31.77 19.81,31.77 18.52,30.48 U$1.GND@2 | X6.GND@4 73.69,76.73 78.72,76.73 X6.GND@3 78.79,76.66 78.79,76.28 87.48,67.59 87.48,64.92 S2.3
  pour Top: 0,0 0,80.01 100.33,80.01 100.33,0
  pour Bottom: 0,0 0,80.01 100.33,80.01 100.33,0
GSM_ANT  (via drill 0.35)
  Top 0.152: v43.74,67.74 42.29,66.29 42.29,65.76 U3.P$66 | v74.98,74.45 76.2,75.67 X6.P
  Bottom 0.152: v43.74,67.74 65.84,67.74 72.54,74.45 v74.98,74.45
N$2  (via drill 0.35)
  Top 0.152: C4.1 3.58,39.4 3.58,42.52 4.04,42.98 4.04,45.72 R2.2 4.12,45.72 4.34,45.95 v4.34,46.63 | v18.9,53.95 19.74,53.11 19.74,52.81 U1.19
  Bottom 0.152: v18.9,53.95 11.66,53.95 v4.34,46.63
N$3
  Top 0.152: P1.4 30.48,3.35 26.59,7.24 26.59,11.51 U$1.D2
N$4
  Top 0.152: P1.5 32.99,2.52 32.08,2.52 30.94,1.37 24.92,1.37 24.08,2.21 24.08,10.21 5.11,29.18 5.11,30.48 U$1.D1
N$5
  Top 0.152: 29.76,72.5 30.86,73.61 L1.2 | 29.76,72.5 29.72,72.47 18.52,72.47 17.6,73.38 17.6,73.61 R1.1 | C3.2 29.79,64.77 29.79,72.47 29.76,72.5
N$6
  Top 0.152: X5.3 65,76.2 65,71.86 62.71,69.57 62.71,46.94 61.19,45.41 60.73,45.41 U3.P$35
N$12
  Top 0.152: X2.2@2 2.67,72.39 2.67,74.52 2.29,74.91 X2.2@5 2.29,74.98 2.67,75.36 2.67,77.5 X2.2@1 2.74,77.57 7.39,77.57 X2.2@4 7.47,77.5 7.47,75.36 7.85,74.98 X2.2@6 | R1.2 17.98,73.69 17.98,73.91 16.99,74.91 7.92,74.91 X2.2@6 | X2.2@3 7.47,72.39 7.47,74.37 7.92,74.83 X2.2@6
N$13
  Top 0.152: U3.P$23 45.26,41 45.26,52.5 46.79,54.03 46.79,54.63 42.75,58.67 42.67,58.67 36.88,64.47 36.88,73.61 JP2.1
N$18
  Top 0.305: R4.2 47.09,76.2 45.72,76.2 LED2.K
N$21  (via drill 0.35)
  Top 0.152: R3.2 59.59,73.66 v58.42,73.66 | v57.15,76.2 55.88,74.93 LED3.K
  Bottom 0.305: v57.15,76.2 57.15,74.93 v58.42,73.66
N$35
  Top 0.152: R5.1 69.04,10.13 61.65,10.13 LED4.K
N$36
  Top 0.152: 69.42,3.81 72.62,3.81 73.91,5.11 IC2.5 | 69.42,3.81 69.42,10.13 R5.2 | 69.42,3.81 R6.2
N$37
  Top 0.152: LED1.A 59.97,2.9 61.95,2.9 62.79,3.73 69.04,3.73 R6.1
NETSTAT  (via drill 0.35)
  Top 0.152: v23.77,40.08 19.51,40.08 IC1.5 | v62.1,59.74 61.72,59.74 61.19,60.27 60.73,60.27 U3.P$50
  Bottom 0.152: v23.77,40.08 30.56,40.08 50.22,59.74 v62.1,59.74
NETSTAT_5V  (via drill 0.35)
  Top 0.152: v48.46,73.38 49.53,73.38 R4.1 | v20.42,41.3 19.81,40.69 19.51,40.69 IC1.6
  Bottom 0.152: v48.46,73.38 20.42,45.34 v20.42,41.3
POWERKEY  (via drill 0.35)
  Top 0.152: v46.18,54.33 35.89,54.33 U3.P$8 | v81,65.46 v69.88,54.33 | S2.2 92.81,77.27 83.97,68.43 S2.1
  Bottom 0.152: v69.88,54.33 v46.18,54.33 | v81,65.46 83.97,68.43 S2.1
POWERSTAT  (via drill 0.35)
  Top 0.152: v21.79,38.1 19.51,38.1 IC1.2 | v62.1,58.75 61.72,58.75 61.19,59.28 60.73,59.28 U3.P$49
  Bottom 0.152: v21.79,38.1 29.03,38.1 49.68,58.75 v62.1,58.75
POWERSTAT_5V  (via drill 0.35)
  Top 0.152: v56.77,67.13 59.66,70.03 59.66,73.38 R3.1 | v20.42,39.47 20.12,39.17 20.12,39.09 19.81,38.79 19.51,38.79 IC1.3
  Bottom 0.152: v56.77,67.13 48.08,67.13 21.72,40.77 21.72,40.54 20.65,39.47 v20.42,39.47
RESET
  Top 0.152: U3.P$16 35.81,46.33 35.36,46.33 31.62,42.6 31.62,39.4 D1.A
RI  (via drill 0.35)
  Top 0.152: v15.85,38.79 13.64,38.79 IC1.12 | v34.14,52.27 35.81,52.27 U3.P$10
  Bottom 0.152: v15.85,38.79 20.65,38.79 v34.14,52.27
RI_5V  (via drill 0.35)
  Top 0.152: v10.74,39.32 13.56,39.32 IC1.11
  Bottom 0.152: v10.74,39.32 3.43,46.63 3.43,52.96 JP1.1
RTS
  Top 0.152: R8.2 29.41,57.15 29.41,55.32 35.36,49.38 35.81,49.38 U3.P$13
SIGFOX_RX  (via drill 0.35)
  Top 0.152: v16.92,54.56 15.47,53.11 15.47,52.81 U1.15
  Bottom 0.152: v16.92,54.56 19.2,54.56 19.51,54.25 19.51,43.36 15.24,39.09 15.24,32.23 16.46,31.01 16.46,29.95 15.77,29.26 11.43,29.26 10.21,30.48 U$1.D3
SIGFOX_TX
  Top 0.152: U1.14 14.25,52.81 14.25,63.48 11.28,66.45 9.98,66.45 9.68,66.14 9.68,33.45 12.65,30.48 U$1.D4
SIM_CLCK  (via drill 0.35)
  Top 0.152: v95.78,36.2 95.78,35.36 IC4.4 | v81.31,50.67 68.5,50.67 X7.C3 68.43,50.67 v65,47.24 | v59.05,47.24 53.26,41.45 53.26,41 U3.P$31
  Bottom 0.152: v81.31,50.67 v95.78,36.2 | v65,47.24 v59.05,47.24
SIM_DATA  (via drill 0.35)
  Top 0.152: 93.08,44.77 93.04,44.81 93.04,49.61 94.11,50.67 X7.C7 | 93.08,44.77 95.17,42.67 95.17,35.36 IC4.5 | v53.34,42.52 52.27,41.45 52.27,41 U3.P$30 | v86.11,42.52 90.83,42.52 93.08,44.77
  Bottom 0.152: v86.11,42.52 v53.34,42.52
SIM_RST
  Top 0.152: IC4.3 95.78,33.3 95.78,33.45 94.41,34.82 81.76,34.82 68.5,48.08 X7.C2 68.43,48.08 60.05,39.7 55.02,39.7 54.33,40.39 54.33,40.92 U3.P$32
UART_RXD
  Top 0.152: U3.P$15 35.81,47.32 31.93,47.32 31.62,47.02 D2.A
UART_TXD
  Top 0.152: IC1.9 13.56,40.69 13.26,40.69 12.88,41.07 12.88,41.6 24.23,52.96 30.79,52.96 35.36,48.39 35.81,48.39 U3.P$14
VBAT  (via drill 0.35)
  Top 0.152: IC2.3 75.89,2.44 80.09,2.44 81,1.52 82.14,1.52 83.52,2.9 83.52,4.5 CN3.2 83.59,4.57 v83.59,9.6 | U3.P$6 35.89,56.39 35.89,57.3 U3.P$5 35.89,57.38 35.89,58.29 U3.P$4 35.97,58.29 v42.14,58.29 | C13.1 75.51,71.17 74.83,71.86 71.32,71.86 70.64,71.17 70.48,71.17 C12.1 70.41,71.09 70.1,71.09 v69.57,70.56 | D6.C 65.46,64.08 65.46,71.09 C11.1
  Bottom 0.152: v69.57,70.56 69.57,64.47 67.36,62.26 D6.C | v42.14,58.29 48.31,58.29 52.2,62.18 67.28,62.18 D6.C | v83.59,9.6 83.59,10.36 91.21,17.98 91.21,38.33 D6.C
VRTC
  Top 0.152: C5.1 29.03,52.05 29.03,48.39 30.02,47.4 30.02,38.02 30.18,37.87 32.99,37.87 35.81,40.69 35.81,45.34 U3.P$17
VSS
  Top 0.152: R7.1 75.97,10.13 75.97,7.01 74.91,5.94 74.91,2.52 IC2.2
WISOL_RF
  Top 0.152: C3.1 22.55,64.77 22.48,64.69 U1.30

### Text on the board
tPlace: Wisol Ant | GPS / Ant | GSM / Ant | Power | GSM Pwr | Power
bPlace: v1 | sensors.AFRICA by Code for Africa